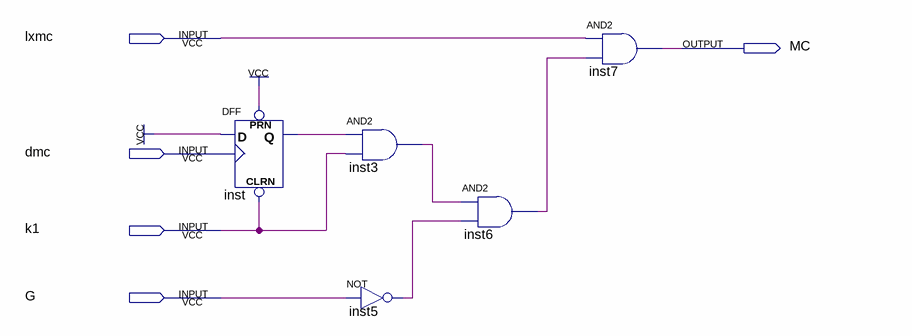
[diagram p0: schematic sheet]
// Quartus schematic lxmc.bdf as structural Verilog: 5 symbols, 5 pins
module lxmc (
  input  lxmc,
  input  dmc,
  input  k1,
  input  G,
  output MC
);

  wire inst3_out, inst5_out, inst6_out, inst_q;

  DFF inst (.CLRN(k1), .CLK(dmc), .D(1'b1), .PRN(1'b1), .Q(inst_q));
  and inst3 (inst3_out, inst_q, k1);
  not inst5 (inst5_out, G);
  and inst6 (inst6_out, inst3_out, inst5_out);
  and inst7 (MC, lxmc, inst6_out);
endmodule
